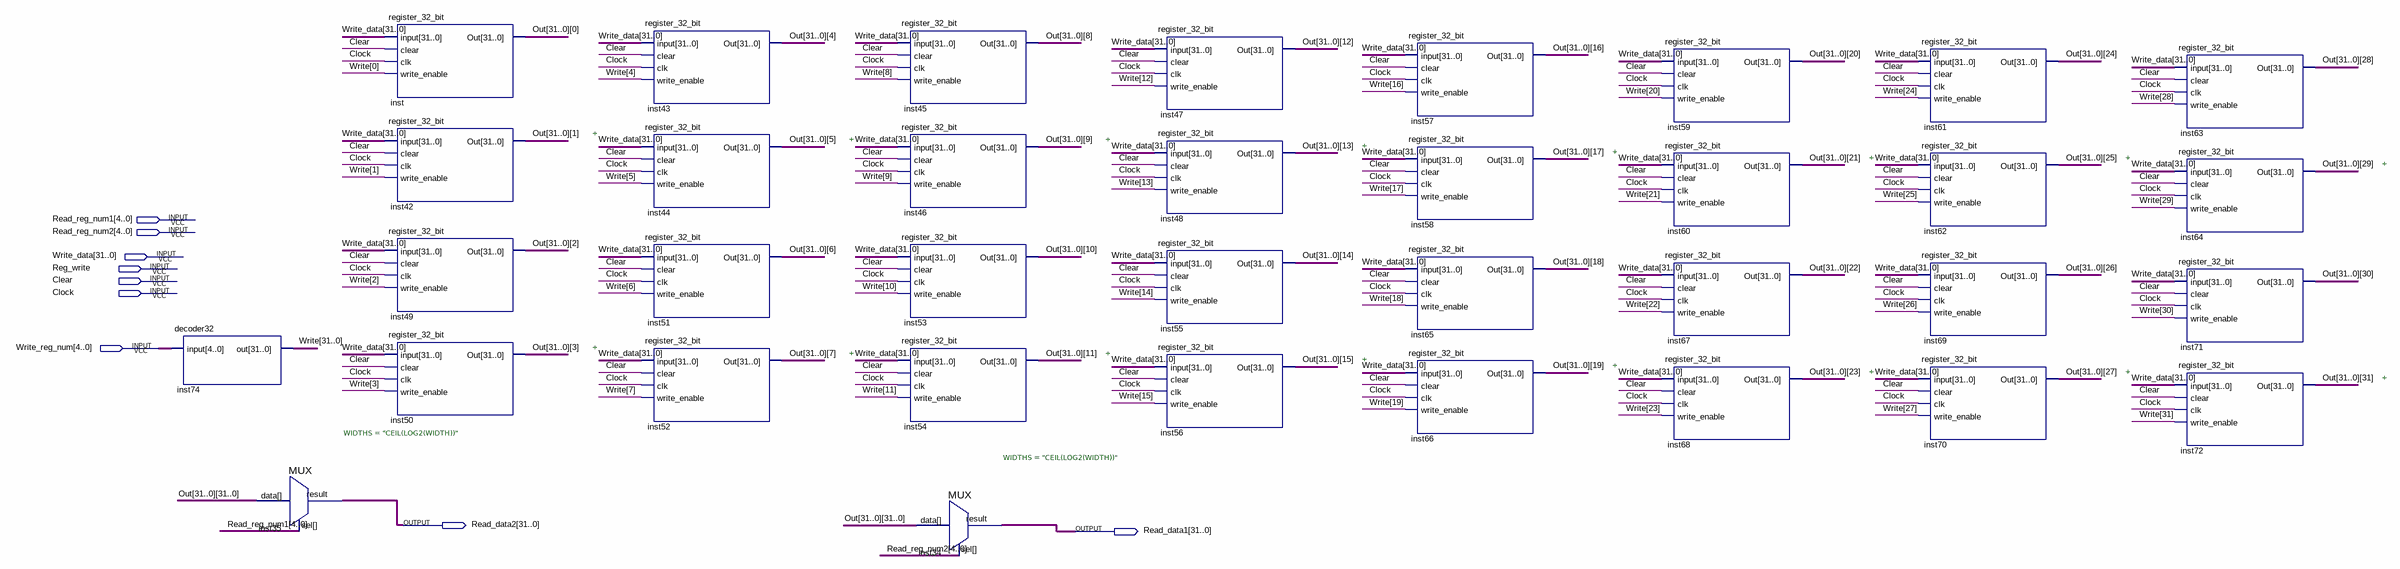
[diagram p0: schematic sheet]
// Quartus schematic Register_File.bdf as structural Verilog: 35 symbols, 9 pins
module Register_File (
  input  [4:0] Read_reg_num1,
  input  [4:0] Read_reg_num2,
  input  [31:0] Write_data,
  input  Reg_write,
  input  Clear,
  input  Clock,
  input  [4:0] Write_reg_num,
  output [31:0] Read_data2,
  output [31:0] Read_data1
);

  wire [31:0] Out_0, Out_1, Out_2, Out_3, Out_4, Out_5, Out_6, Out_7, Out_8, Out_9, Out_10, Out_11, Out_12,
       Out_13, Out_14, Out_15, Out_16, Out_17, Out_18, Out_19, Out_20, Out_21, Out_22, Out_23, Out_24,
       Out_25, Out_26, Out_27, Out_28, Out_29, Out_30, Out_31, Write;

  decoder32 inst74 (.\input (Write_reg_num), .out(Write));
  MUX #(.WIDTHS("CEIL(LOG2(WIDTH))")) inst35 (
    .data({Out_31, Out_30, Out_29, Out_28, Out_27, Out_26, Out_25, Out_24, Out_23, Out_22, Out_21, Out_20, Out_19, Out_18, Out_17, Out_16, Out_15, Out_14, Out_13, Out_12, Out_11, Out_10, Out_9, Out_8, Out_7, Out_6, Out_5, Out_4, Out_3, Out_2, Out_1, Out_0}),
    .sel(Read_reg_num1), .result(Read_data2));
  register_32_bit inst (
    .\input (Write_data), .clear(Clear), .clk(Clock), .write_enable(Write[0]),
    .Out({Out_31[0], Out_30[0], Out_29[0], Out_28[0], Out_27[0], Out_26[0], Out_25[0], Out_24[0], Out_23[0], Out_22[0], Out_21[0], Out_20[0], Out_19[0], Out_18[0], Out_17[0], Out_16[0], Out_15[0], Out_14[0], Out_13[0], Out_12[0], Out_11[0], Out_10[0], Out_9[0], Out_8[0], Out_7[0], Out_6[0], Out_5[0], Out_4[0], Out_3[0], Out_2[0], Out_1[0], Out_0[0]}));
  register_32_bit inst42 (
    .\input (Write_data), .clear(Clear), .clk(Clock), .write_enable(Write[1]),
    .Out({Out_31[1], Out_30[1], Out_29[1], Out_28[1], Out_27[1], Out_26[1], Out_25[1], Out_24[1], Out_23[1], Out_22[1], Out_21[1], Out_20[1], Out_19[1], Out_18[1], Out_17[1], Out_16[1], Out_15[1], Out_14[1], Out_13[1], Out_12[1], Out_11[1], Out_10[1], Out_9[1], Out_8[1], Out_7[1], Out_6[1], Out_5[1], Out_4[1], Out_3[1], Out_2[1], Out_1[1], Out_0[1]}));
  register_32_bit inst49 (
    .\input (Write_data), .clear(Clear), .clk(Clock), .write_enable(Write[2]),
    .Out({Out_31[2], Out_30[2], Out_29[2], Out_28[2], Out_27[2], Out_26[2], Out_25[2], Out_24[2], Out_23[2], Out_22[2], Out_21[2], Out_20[2], Out_19[2], Out_18[2], Out_17[2], Out_16[2], Out_15[2], Out_14[2], Out_13[2], Out_12[2], Out_11[2], Out_10[2], Out_9[2], Out_8[2], Out_7[2], Out_6[2], Out_5[2], Out_4[2], Out_3[2], Out_2[2], Out_1[2], Out_0[2]}));
  register_32_bit inst50 (
    .\input (Write_data), .clear(Clear), .clk(Clock), .write_enable(Write[3]),
    .Out({Out_31[3], Out_30[3], Out_29[3], Out_28[3], Out_27[3], Out_26[3], Out_25[3], Out_24[3], Out_23[3], Out_22[3], Out_21[3], Out_20[3], Out_19[3], Out_18[3], Out_17[3], Out_16[3], Out_15[3], Out_14[3], Out_13[3], Out_12[3], Out_11[3], Out_10[3], Out_9[3], Out_8[3], Out_7[3], Out_6[3], Out_5[3], Out_4[3], Out_3[3], Out_2[3], Out_1[3], Out_0[3]}));
  register_32_bit inst43 (
    .\input (Write_data), .clear(Clear), .clk(Clock), .write_enable(Write[4]),
    .Out({Out_31[4], Out_30[4], Out_29[4], Out_28[4], Out_27[4], Out_26[4], Out_25[4], Out_24[4], Out_23[4], Out_22[4], Out_21[4], Out_20[4], Out_19[4], Out_18[4], Out_17[4], Out_16[4], Out_15[4], Out_14[4], Out_13[4], Out_12[4], Out_11[4], Out_10[4], Out_9[4], Out_8[4], Out_7[4], Out_6[4], Out_5[4], Out_4[4], Out_3[4], Out_2[4], Out_1[4], Out_0[4]}));
  register_32_bit inst44 (
    .\input (Write_data), .clear(Clear), .clk(Clock), .write_enable(Write[5]),
    .Out({Out_31[5], Out_30[5], Out_29[5], Out_28[5], Out_27[5], Out_26[5], Out_25[5], Out_24[5], Out_23[5], Out_22[5], Out_21[5], Out_20[5], Out_19[5], Out_18[5], Out_17[5], Out_16[5], Out_15[5], Out_14[5], Out_13[5], Out_12[5], Out_11[5], Out_10[5], Out_9[5], Out_8[5], Out_7[5], Out_6[5], Out_5[5], Out_4[5], Out_3[5], Out_2[5], Out_1[5], Out_0[5]}));
  register_32_bit inst51 (
    .\input (Write_data), .clear(Clear), .clk(Clock), .write_enable(Write[6]),
    .Out({Out_31[6], Out_30[6], Out_29[6], Out_28[6], Out_27[6], Out_26[6], Out_25[6], Out_24[6], Out_23[6], Out_22[6], Out_21[6], Out_20[6], Out_19[6], Out_18[6], Out_17[6], Out_16[6], Out_15[6], Out_14[6], Out_13[6], Out_12[6], Out_11[6], Out_10[6], Out_9[6], Out_8[6], Out_7[6], Out_6[6], Out_5[6], Out_4[6], Out_3[6], Out_2[6], Out_1[6], Out_0[6]}));
  register_32_bit inst52 (
    .\input (Write_data), .clear(Clear), .clk(Clock), .write_enable(Write[7]),
    .Out({Out_31[7], Out_30[7], Out_29[7], Out_28[7], Out_27[7], Out_26[7], Out_25[7], Out_24[7], Out_23[7], Out_22[7], Out_21[7], Out_20[7], Out_19[7], Out_18[7], Out_17[7], Out_16[7], Out_15[7], Out_14[7], Out_13[7], Out_12[7], Out_11[7], Out_10[7], Out_9[7], Out_8[7], Out_7[7], Out_6[7], Out_5[7], Out_4[7], Out_3[7], Out_2[7], Out_1[7], Out_0[7]}));
  register_32_bit inst45 (
    .\input (Write_data), .clear(Clear), .clk(Clock), .write_enable(Write[8]),
    .Out({Out_31[8], Out_30[8], Out_29[8], Out_28[8], Out_27[8], Out_26[8], Out_25[8], Out_24[8], Out_23[8], Out_22[8], Out_21[8], Out_20[8], Out_19[8], Out_18[8], Out_17[8], Out_16[8], Out_15[8], Out_14[8], Out_13[8], Out_12[8], Out_11[8], Out_10[8], Out_9[8], Out_8[8], Out_7[8], Out_6[8], Out_5[8], Out_4[8], Out_3[8], Out_2[8], Out_1[8], Out_0[8]}));
  register_32_bit inst46 (
    .\input (Write_data), .clear(Clear), .clk(Clock), .write_enable(Write[9]),
    .Out({Out_31[9], Out_30[9], Out_29[9], Out_28[9], Out_27[9], Out_26[9], Out_25[9], Out_24[9], Out_23[9], Out_22[9], Out_21[9], Out_20[9], Out_19[9], Out_18[9], Out_17[9], Out_16[9], Out_15[9], Out_14[9], Out_13[9], Out_12[9], Out_11[9], Out_10[9], Out_9[9], Out_8[9], Out_7[9], Out_6[9], Out_5[9], Out_4[9], Out_3[9], Out_2[9], Out_1[9], Out_0[9]}));
  register_32_bit inst53 (
    .\input (Write_data), .clear(Clear), .clk(Clock), .write_enable(Write[10]),
    .Out({Out_31[10], Out_30[10], Out_29[10], Out_28[10], Out_27[10], Out_26[10], Out_25[10], Out_24[10], Out_23[10], Out_22[10], Out_21[10], Out_20[10], Out_19[10], Out_18[10], Out_17[10], Out_16[10], Out_15[10], Out_14[10], Out_13[10], Out_12[10], Out_11[10], Out_10[10], Out_9[10], Out_8[10], Out_7[10], Out_6[10], Out_5[10], Out_4[10], Out_3[10], Out_2[10], Out_1[10], Out_0[10]}));
  register_32_bit inst54 (
    .\input (Write_data), .clear(Clear), .clk(Clock), .write_enable(Write[11]),
    .Out({Out_31[11], Out_30[11], Out_29[11], Out_28[11], Out_27[11], Out_26[11], Out_25[11], Out_24[11], Out_23[11], Out_22[11], Out_21[11], Out_20[11], Out_19[11], Out_18[11], Out_17[11], Out_16[11], Out_15[11], Out_14[11], Out_13[11], Out_12[11], Out_11[11], Out_10[11], Out_9[11], Out_8[11], Out_7[11], Out_6[11], Out_5[11], Out_4[11], Out_3[11], Out_2[11], Out_1[11], Out_0[11]}));
  MUX #(.WIDTHS("CEIL(LOG2(WIDTH))")) inst34 (
    .data({Out_31, Out_30, Out_29, Out_28, Out_27, Out_26, Out_25, Out_24, Out_23, Out_22, Out_21, Out_20, Out_19, Out_18, Out_17, Out_16, Out_15, Out_14, Out_13, Out_12, Out_11, Out_10, Out_9, Out_8, Out_7, Out_6, Out_5, Out_4, Out_3, Out_2, Out_1, Out_0}),
    .sel(Read_reg_num2), .result(Read_data1));
  register_32_bit inst47 (
    .\input (Write_data), .clear(Clear), .clk(Clock), .write_enable(Write[12]),
    .Out({Out_31[12], Out_30[12], Out_29[12], Out_28[12], Out_27[12], Out_26[12], Out_25[12], Out_24[12], Out_23[12], Out_22[12], Out_21[12], Out_20[12], Out_19[12], Out_18[12], Out_17[12], Out_16[12], Out_15[12], Out_14[12], Out_13[12], Out_12[12], Out_11[12], Out_10[12], Out_9[12], Out_8[12], Out_7[12], Out_6[12], Out_5[12], Out_4[12], Out_3[12], Out_2[12], Out_1[12], Out_0[12]}));
  register_32_bit inst48 (
    .\input (Write_data), .clear(Clear), .clk(Clock), .write_enable(Write[13]),
    .Out({Out_31[13], Out_30[13], Out_29[13], Out_28[13], Out_27[13], Out_26[13], Out_25[13], Out_24[13], Out_23[13], Out_22[13], Out_21[13], Out_20[13], Out_19[13], Out_18[13], Out_17[13], Out_16[13], Out_15[13], Out_14[13], Out_13[13], Out_12[13], Out_11[13], Out_10[13], Out_9[13], Out_8[13], Out_7[13], Out_6[13], Out_5[13], Out_4[13], Out_3[13], Out_2[13], Out_1[13], Out_0[13]}));
  register_32_bit inst55 (
    .\input (Write_data), .clear(Clear), .clk(Clock), .write_enable(Write[14]),
    .Out({Out_31[14], Out_30[14], Out_29[14], Out_28[14], Out_27[14], Out_26[14], Out_25[14], Out_24[14], Out_23[14], Out_22[14], Out_21[14], Out_20[14], Out_19[14], Out_18[14], Out_17[14], Out_16[14], Out_15[14], Out_14[14], Out_13[14], Out_12[14], Out_11[14], Out_10[14], Out_9[14], Out_8[14], Out_7[14], Out_6[14], Out_5[14], Out_4[14], Out_3[14], Out_2[14], Out_1[14], Out_0[14]}));
  register_32_bit inst56 (
    .\input (Write_data), .clear(Clear), .clk(Clock), .write_enable(Write[15]),
    .Out({Out_31[15], Out_30[15], Out_29[15], Out_28[15], Out_27[15], Out_26[15], Out_25[15], Out_24[15], Out_23[15], Out_22[15], Out_21[15], Out_20[15], Out_19[15], Out_18[15], Out_17[15], Out_16[15], Out_15[15], Out_14[15], Out_13[15], Out_12[15], Out_11[15], Out_10[15], Out_9[15], Out_8[15], Out_7[15], Out_6[15], Out_5[15], Out_4[15], Out_3[15], Out_2[15], Out_1[15], Out_0[15]}));
  register_32_bit inst57 (
    .\input (Write_data), .clear(Clear), .clk(Clock), .write_enable(Write[16]),
    .Out({Out_31[16], Out_30[16], Out_29[16], Out_28[16], Out_27[16], Out_26[16], Out_25[16], Out_24[16], Out_23[16], Out_22[16], Out_21[16], Out_20[16], Out_19[16], Out_18[16], Out_17[16], Out_16[16], Out_15[16], Out_14[16], Out_13[16], Out_12[16], Out_11[16], Out_10[16], Out_9[16], Out_8[16], Out_7[16], Out_6[16], Out_5[16], Out_4[16], Out_3[16], Out_2[16], Out_1[16], Out_0[16]}));
  register_32_bit inst58 (
    .\input (Write_data), .clear(Clear), .clk(Clock), .write_enable(Write[17]),
    .Out({Out_31[17], Out_30[17], Out_29[17], Out_28[17], Out_27[17], Out_26[17], Out_25[17], Out_24[17], Out_23[17], Out_22[17], Out_21[17], Out_20[17], Out_19[17], Out_18[17], Out_17[17], Out_16[17], Out_15[17], Out_14[17], Out_13[17], Out_12[17], Out_11[17], Out_10[17], Out_9[17], Out_8[17], Out_7[17], Out_6[17], Out_5[17], Out_4[17], Out_3[17], Out_2[17], Out_1[17], Out_0[17]}));
  register_32_bit inst65 (
    .\input (Write_data), .clear(Clear), .clk(Clock), .write_enable(Write[18]),
    .Out({Out_31[18], Out_30[18], Out_29[18], Out_28[18], Out_27[18], Out_26[18], Out_25[18], Out_24[18], Out_23[18], Out_22[18], Out_21[18], Out_20[18], Out_19[18], Out_18[18], Out_17[18], Out_16[18], Out_15[18], Out_14[18], Out_13[18], Out_12[18], Out_11[18], Out_10[18], Out_9[18], Out_8[18], Out_7[18], Out_6[18], Out_5[18], Out_4[18], Out_3[18], Out_2[18], Out_1[18], Out_0[18]}));
  register_32_bit inst66 (
    .\input (Write_data), .clear(Clear), .clk(Clock), .write_enable(Write[19]),
    .Out({Out_31[19], Out_30[19], Out_29[19], Out_28[19], Out_27[19], Out_26[19], Out_25[19], Out_24[19], Out_23[19], Out_22[19], Out_21[19], Out_20[19], Out_19[19], Out_18[19], Out_17[19], Out_16[19], Out_15[19], Out_14[19], Out_13[19], Out_12[19], Out_11[19], Out_10[19], Out_9[19], Out_8[19], Out_7[19], Out_6[19], Out_5[19], Out_4[19], Out_3[19], Out_2[19], Out_1[19], Out_0[19]}));
  register_32_bit inst59 (
    .\input (Write_data), .clear(Clear), .clk(Clock), .write_enable(Write[20]),
    .Out({Out_31[20], Out_30[20], Out_29[20], Out_28[20], Out_27[20], Out_26[20], Out_25[20], Out_24[20], Out_23[20], Out_22[20], Out_21[20], Out_20[20], Out_19[20], Out_18[20], Out_17[20], Out_16[20], Out_15[20], Out_14[20], Out_13[20], Out_12[20], Out_11[20], Out_10[20], Out_9[20], Out_8[20], Out_7[20], Out_6[20], Out_5[20], Out_4[20], Out_3[20], Out_2[20], Out_1[20], Out_0[20]}));
  register_32_bit inst60 (
    .\input (Write_data), .clear(Clear), .clk(Clock), .write_enable(Write[21]),
    .Out({Out_31[21], Out_30[21], Out_29[21], Out_28[21], Out_27[21], Out_26[21], Out_25[21], Out_24[21], Out_23[21], Out_22[21], Out_21[21], Out_20[21], Out_19[21], Out_18[21], Out_17[21], Out_16[21], Out_15[21], Out_14[21], Out_13[21], Out_12[21], Out_11[21], Out_10[21], Out_9[21], Out_8[21], Out_7[21], Out_6[21], Out_5[21], Out_4[21], Out_3[21], Out_2[21], Out_1[21], Out_0[21]}));
  register_32_bit inst67 (
    .\input (Write_data), .clear(Clear), .clk(Clock), .write_enable(Write[22]),
    .Out({Out_31[22], Out_30[22], Out_29[22], Out_28[22], Out_27[22], Out_26[22], Out_25[22], Out_24[22], Out_23[22], Out_22[22], Out_21[22], Out_20[22], Out_19[22], Out_18[22], Out_17[22], Out_16[22], Out_15[22], Out_14[22], Out_13[22], Out_12[22], Out_11[22], Out_10[22], Out_9[22], Out_8[22], Out_7[22], Out_6[22], Out_5[22], Out_4[22], Out_3[22], Out_2[22], Out_1[22], Out_0[22]}));
  register_32_bit inst68 (
    .\input (Write_data), .clear(Clear), .clk(Clock), .write_enable(Write[23]),
    .Out({Out_31[23], Out_30[23], Out_29[23], Out_28[23], Out_27[23], Out_26[23], Out_25[23], Out_24[23], Out_23[23], Out_22[23], Out_21[23], Out_20[23], Out_19[23], Out_18[23], Out_17[23], Out_16[23], Out_15[23], Out_14[23], Out_13[23], Out_12[23], Out_11[23], Out_10[23], Out_9[23], Out_8[23], Out_7[23], Out_6[23], Out_5[23], Out_4[23], Out_3[23], Out_2[23], Out_1[23], Out_0[23]}));
  register_32_bit inst61 (
    .\input (Write_data), .clear(Clear), .clk(Clock), .write_enable(Write[24]),
    .Out({Out_31[24], Out_30[24], Out_29[24], Out_28[24], Out_27[24], Out_26[24], Out_25[24], Out_24[24], Out_23[24], Out_22[24], Out_21[24], Out_20[24], Out_19[24], Out_18[24], Out_17[24], Out_16[24], Out_15[24], Out_14[24], Out_13[24], Out_12[24], Out_11[24], Out_10[24], Out_9[24], Out_8[24], Out_7[24], Out_6[24], Out_5[24], Out_4[24], Out_3[24], Out_2[24], Out_1[24], Out_0[24]}));
  register_32_bit inst62 (
    .\input (Write_data), .clear(Clear), .clk(Clock), .write_enable(Write[25]),
    .Out({Out_31[25], Out_30[25], Out_29[25], Out_28[25], Out_27[25], Out_26[25], Out_25[25], Out_24[25], Out_23[25], Out_22[25], Out_21[25], Out_20[25], Out_19[25], Out_18[25], Out_17[25], Out_16[25], Out_15[25], Out_14[25], Out_13[25], Out_12[25], Out_11[25], Out_10[25], Out_9[25], Out_8[25], Out_7[25], Out_6[25], Out_5[25], Out_4[25], Out_3[25], Out_2[25], Out_1[25], Out_0[25]}));
  register_32_bit inst69 (
    .\input (Write_data), .clear(Clear), .clk(Clock), .write_enable(Write[26]),
    .Out({Out_31[26], Out_30[26], Out_29[26], Out_28[26], Out_27[26], Out_26[26], Out_25[26], Out_24[26], Out_23[26], Out_22[26], Out_21[26], Out_20[26], Out_19[26], Out_18[26], Out_17[26], Out_16[26], Out_15[26], Out_14[26], Out_13[26], Out_12[26], Out_11[26], Out_10[26], Out_9[26], Out_8[26], Out_7[26], Out_6[26], Out_5[26], Out_4[26], Out_3[26], Out_2[26], Out_1[26], Out_0[26]}));
  register_32_bit inst70 (
    .\input (Write_data), .clear(Clear), .clk(Clock), .write_enable(Write[27]),
    .Out({Out_31[27], Out_30[27], Out_29[27], Out_28[27], Out_27[27], Out_26[27], Out_25[27], Out_24[27], Out_23[27], Out_22[27], Out_21[27], Out_20[27], Out_19[27], Out_18[27], Out_17[27], Out_16[27], Out_15[27], Out_14[27], Out_13[27], Out_12[27], Out_11[27], Out_10[27], Out_9[27], Out_8[27], Out_7[27], Out_6[27], Out_5[27], Out_4[27], Out_3[27], Out_2[27], Out_1[27], Out_0[27]}));
  register_32_bit inst63 (
    .\input (Write_data), .clear(Clear), .clk(Clock), .write_enable(Write[28]),
    .Out({Out_31[28], Out_30[28], Out_29[28], Out_28[28], Out_27[28], Out_26[28], Out_25[28], Out_24[28], Out_23[28], Out_22[28], Out_21[28], Out_20[28], Out_19[28], Out_18[28], Out_17[28], Out_16[28], Out_15[28], Out_14[28], Out_13[28], Out_12[28], Out_11[28], Out_10[28], Out_9[28], Out_8[28], Out_7[28], Out_6[28], Out_5[28], Out_4[28], Out_3[28], Out_2[28], Out_1[28], Out_0[28]}));
  register_32_bit inst64 (
    .\input (Write_data), .clear(Clear), .clk(Clock), .write_enable(Write[29]),
    .Out({Out_31[29], Out_30[29], Out_29[29], Out_28[29], Out_27[29], Out_26[29], Out_25[29], Out_24[29], Out_23[29], Out_22[29], Out_21[29], Out_20[29], Out_19[29], Out_18[29], Out_17[29], Out_16[29], Out_15[29], Out_14[29], Out_13[29], Out_12[29], Out_11[29], Out_10[29], Out_9[29], Out_8[29], Out_7[29], Out_6[29], Out_5[29], Out_4[29], Out_3[29], Out_2[29], Out_1[29], Out_0[29]}));
  register_32_bit inst71 (
    .\input (Write_data), .clear(Clear), .clk(Clock), .write_enable(Write[30]),
    .Out({Out_31[30], Out_30[30], Out_29[30], Out_28[30], Out_27[30], Out_26[30], Out_25[30], Out_24[30], Out_23[30], Out_22[30], Out_21[30], Out_20[30], Out_19[30], Out_18[30], Out_17[30], Out_16[30], Out_15[30], Out_14[30], Out_13[30], Out_12[30], Out_11[30], Out_10[30], Out_9[30], Out_8[30], Out_7[30], Out_6[30], Out_5[30], Out_4[30], Out_3[30], Out_2[30], Out_1[30], Out_0[30]}));
  register_32_bit inst72 (
    .\input (Write_data), .clear(Clear), .clk(Clock), .write_enable(Write[31]),
    .Out({Out_31[31], Out_30[31], Out_29[31], Out_28[31], Out_27[31], Out_26[31], Out_25[31], Out_24[31], Out_23[31], Out_22[31], Out_21[31], Out_20[31], Out_19[31], Out_18[31], Out_17[31], Out_16[31], Out_15[31], Out_14[31], Out_13[31], Out_12[31], Out_11[31], Out_10[31], Out_9[31], Out_8[31], Out_7[31], Out_6[31], Out_5[31], Out_4[31], Out_3[31], Out_2[31], Out_1[31], Out_0[31]}));

  // Notes on the sheet:
  //   +
  //   +
  //   +
  //   +
  //   +
  //   +
  //   +
  //   +
  //   +
  //   +
  //   +
  //   +
  //   +
  //   +
  //   +
  //   +
endmodule
